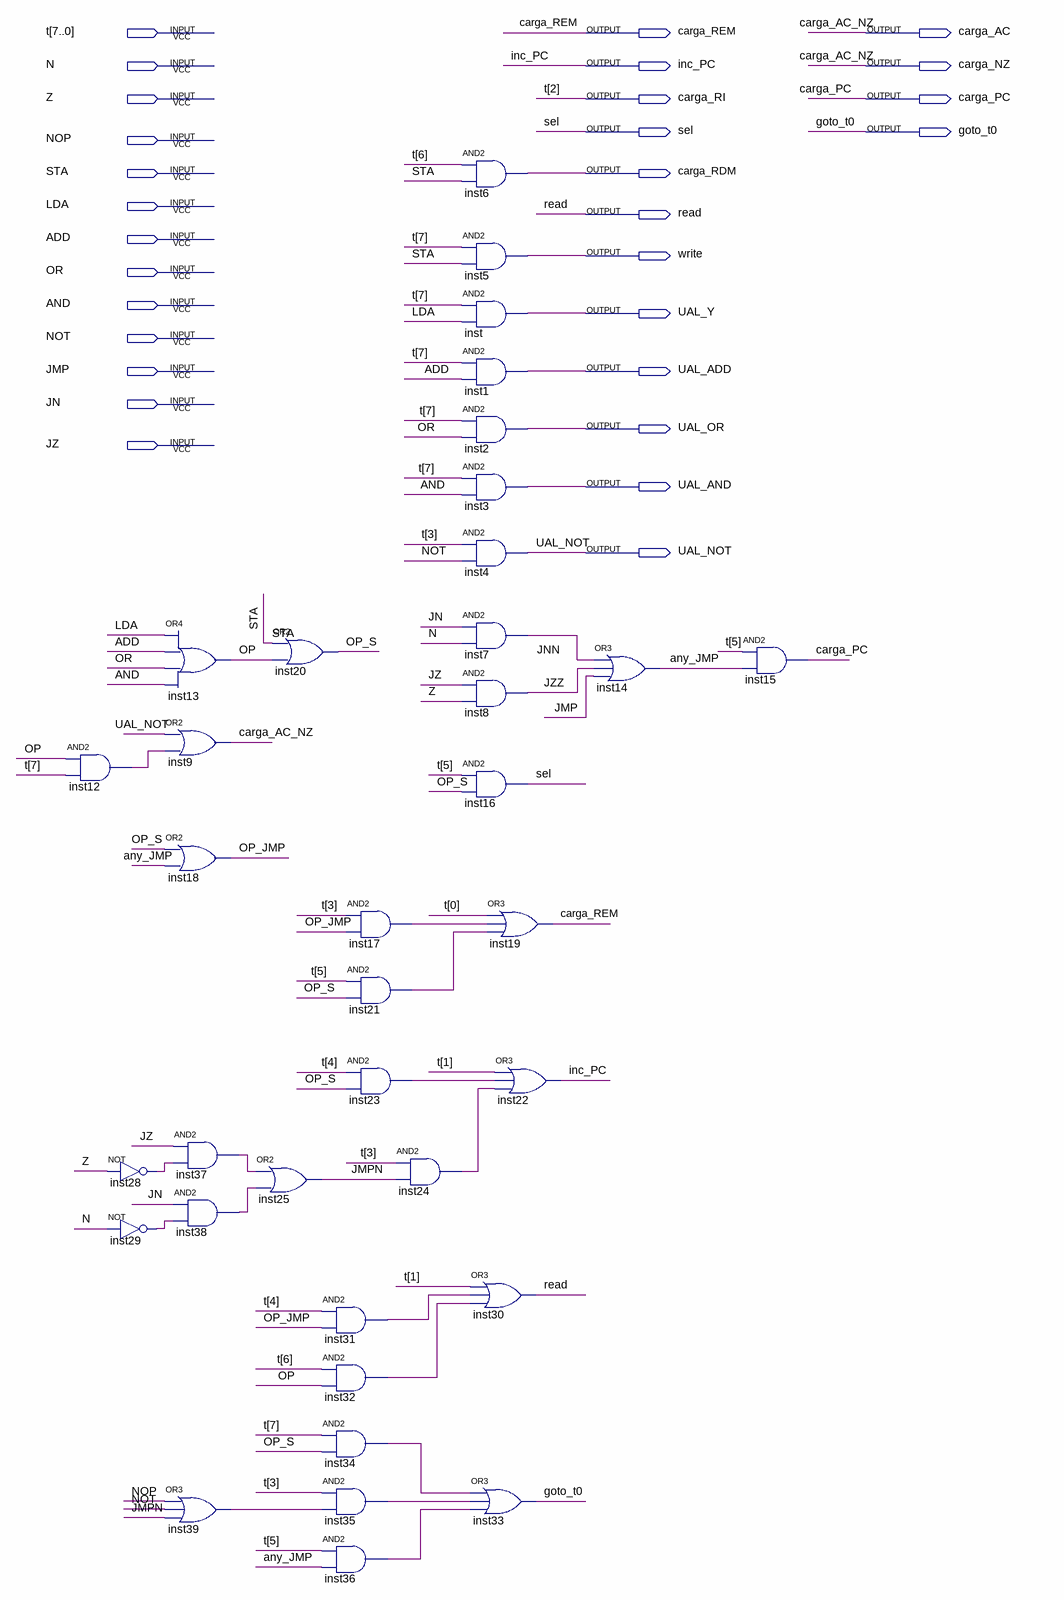
[diagram p0: schematic sheet]
// Quartus schematic unidade_controle.bdf as structural Verilog: 36 symbols, 29 pins
module unidade_controle (
  input  [7:0] t,
  input  N,
  input  Z,
  input  NOP,
  input  STA,
  input  LDA,
  input  ADD,
  input  OR,
  input  AND,
  input  NOT,
  input  JMP,
  input  JN,
  input  JZ,
  output carga_REM,
  output carga_AC,
  output inc_PC,
  output carga_NZ,
  output carga_RI,
  output carga_PC,
  output sel,
  output goto_t0,
  output carga_RDM,
  output read,
  output write,
  output UAL_Y,
  output UAL_ADD,
  output UAL_OR,
  output UAL_AND,
  output UAL_NOT
);

  wire any_JMP, inst12_out, inst17_out, inst21_out, inst23_out, inst24_out, inst28_out, inst29_out,
       inst31_out, inst32_out, inst34_out, inst35_out, inst36_out, inst37_out, inst38_out, inst39_out, JMPN,
       JNN, JZZ, OP, OP_JMP, OP_S;

  and inst12 (inst12_out, OP, t[7]);
  not inst28 (inst28_out, Z);
  not inst29 (inst29_out, N);
  or inst13 (OP, LDA, ADD, OR, AND);
  or inst9 (carga_AC, UAL_NOT, inst12_out);
  or inst18 (OP_JMP, OP_S, any_JMP);
  and inst37 (inst37_out, JZ, inst28_out);
  and inst38 (inst38_out, JN, inst29_out);
  or inst39 (inst39_out, NOP, NOT, JMPN);
  or inst20 (OP_S, STA, OP);
  or inst25 (JMPN, inst37_out, inst38_out);
  and inst17 (inst17_out, t[3], OP_JMP);
  and inst21 (inst21_out, t[5], OP_S);
  and inst23 (inst23_out, t[4], OP_S);
  and inst31 (inst31_out, t[4], OP_JMP);
  and inst32 (inst32_out, t[6], OP);
  and inst34 (inst34_out, t[7], OP_S);
  and inst35 (inst35_out, t[3], inst39_out);
  and inst36 (inst36_out, t[5], any_JMP);
  and inst24 (inst24_out, t[3], JMPN);
  and inst6 (carga_RDM, t[6], STA);
  and inst5 (write, t[7], STA);
  and inst (UAL_Y, t[7], LDA);
  and inst1 (UAL_ADD, t[7], ADD);
  and inst2 (UAL_OR, t[7], OR);
  and inst3 (UAL_AND, t[7], AND);
  and inst4 (UAL_NOT, t[3], NOT);
  and inst7 (JNN, JN, N);
  and inst8 (JZZ, JZ, Z);
  and inst16 (sel, t[5], OP_S);
  or inst19 (carga_REM, t[0], inst17_out, inst21_out);
  or inst22 (inc_PC, t[1], inst23_out, inst24_out);
  or inst30 (read, t[1], inst31_out, inst32_out);
  or inst33 (goto_t0, inst34_out, inst35_out, inst36_out);
  or inst14 (any_JMP, JNN, JZZ, JMP);
  and inst15 (carga_PC, t[5], any_JMP);

  assign carga_NZ = carga_AC;
  assign carga_RI = t[2];

  // Other names for the same wires on the sheet: carga_AC_NZ = carga_AC
endmodule
